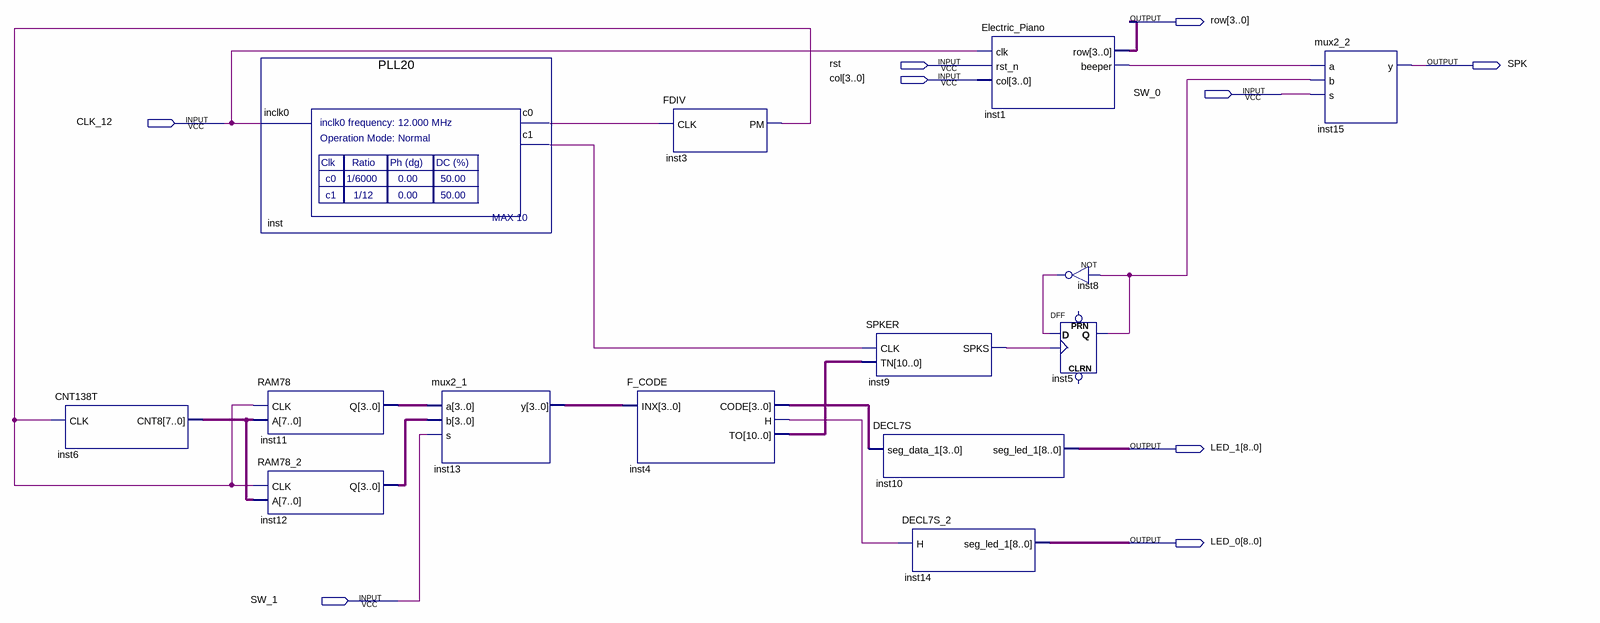
[diagram p0: schematic sheet]
// Quartus schematic music.bdf as structural Verilog: 14 symbols, 9 pins
module music (
  input  rst,
  input  [3:0] col,
  input  SW_0,
  input  CLK_12,
  input  SW_1,
  output [3:0] row,
  output SPK,
  output [8:0] LED_1,
  output [8:0] LED_0
);

  wire inst1_beeper, inst3_pm, inst4_h, inst5_q, inst8_out, inst9_spks, inst_c0, inst_c1;
  wire [3:0] inst4_code, inst11_q, inst12_q, inst13_y;
  wire [7:0] inst6_cnt8;
  wire [10:0] inst4_to;

  CNT138T inst6 (.CLK(inst3_pm), .CNT8(inst6_cnt8));
  PLL20 inst (.inclk0(CLK_12), .c0(inst_c0), .c1(inst_c1));
  RAM78 inst11 (.CLK(inst3_pm), .A(inst6_cnt8), .Q(inst11_q));
  RAM78_2 inst12 (.CLK(inst3_pm), .A(inst6_cnt8), .Q(inst12_q));
  mux2_1 inst13 (.a(inst11_q), .b(inst12_q), .s(SW_1), .y(inst13_y));
  F_CODE inst4 (.INX(inst13_y), .CODE(inst4_code), .H(inst4_h), .TO(inst4_to));
  FDIV inst3 (.CLK(inst_c0), .PM(inst3_pm));
  SPKER inst9 (.CLK(inst_c1), .TN(inst4_to), .SPKS(inst9_spks));
  DECL7S inst10 (.seg_data_1(inst4_code), .seg_led_1(LED_1));
  DECL7S_2 inst14 (.H(inst4_h), .seg_led_1(LED_0));
  Electric_Piano inst1 (.clk(CLK_12), .rst_n(rst), .col(col), .row(row), .beeper(inst1_beeper));
  DFF inst5 (.CLK(inst9_spks), .D(inst8_out), .Q(inst5_q));  // open: CLRN, PRN
  not inst8 (inst8_out, inst5_q);
  mux2_2 inst15 (.a(inst1_beeper), .b(inst5_q), .s(SW_0), .y(SPK));
endmodule
